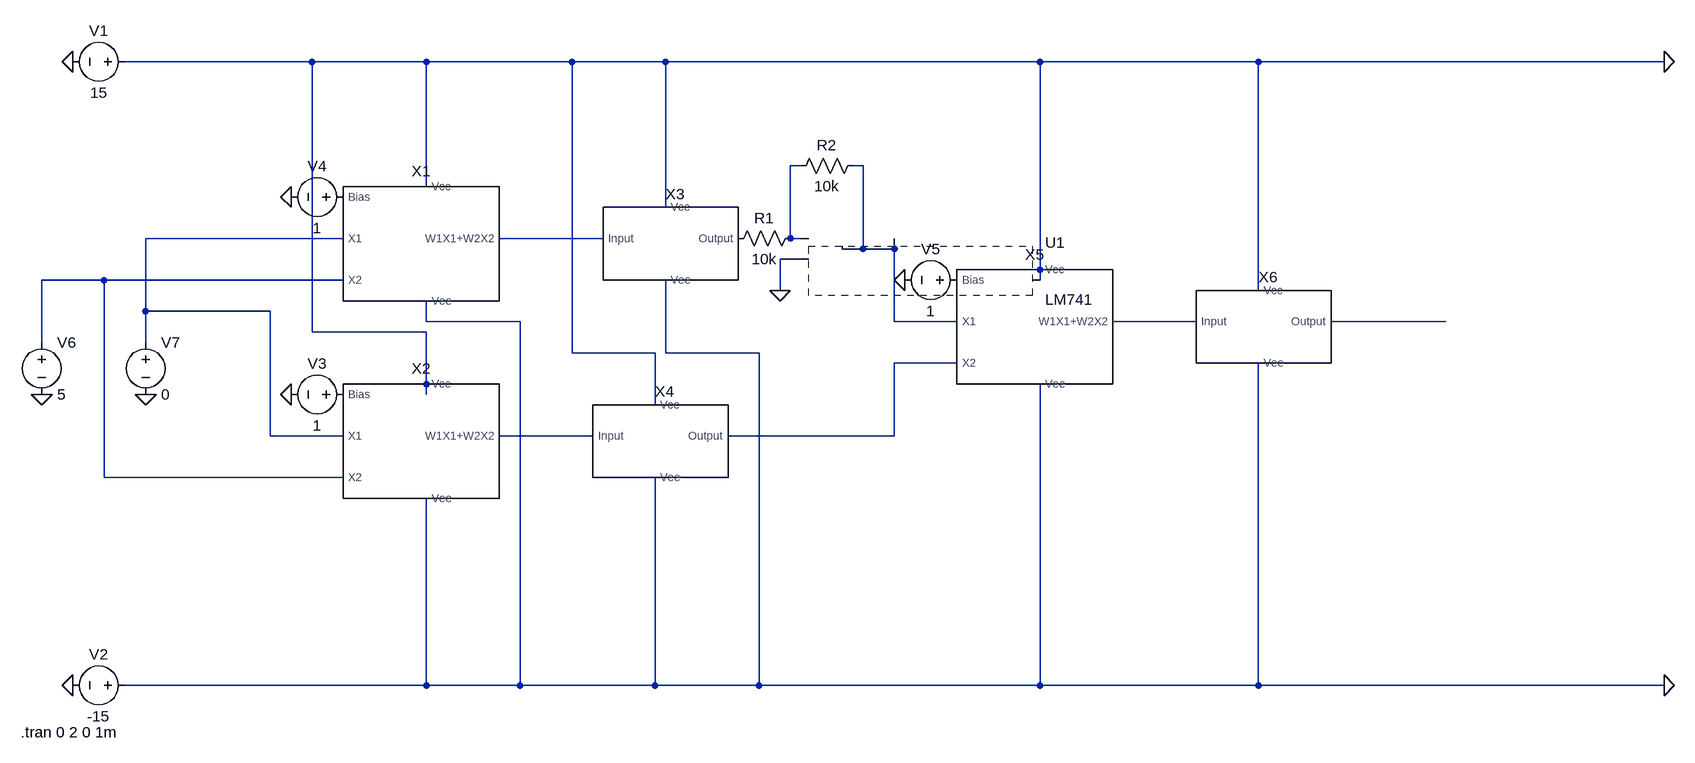
[diagram p0: schematic ANN.asc]
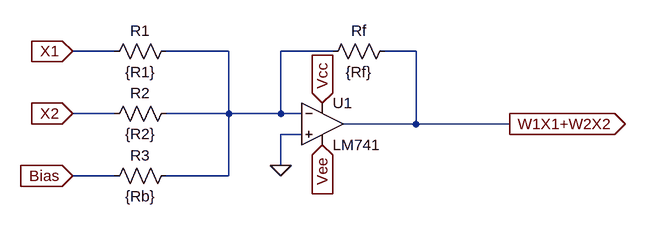
[diagram p1: sub-circuit weight_adder.asc]
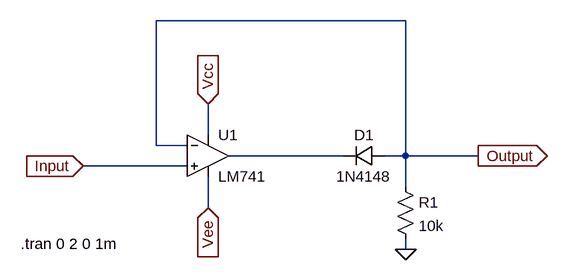
[diagram p2: sub-circuit relu.asc]
ANN.asc, the LTspice schematic file:
Version 4.1
SHEET 1 2036 840
WIRE -64 -208 -352 -208
WIRE 112 -208 -64 -208
WIRE 336 -208 112 -208
WIRE 480 -208 336 -208
WIRE 1056 -208 480 -208
WIRE 1392 -208 1056 -208
WIRE 2016 -208 1392 -208
WIRE 688 -48 672 -48
WIRE 784 -48 768 -48
WIRE 112 -16 112 -208
WIRE 480 16 480 -208
WIRE -16 64 -320 64
WIRE 384 64 224 64
WIRE 672 64 672 -48
WIRE 688 64 672 64
WIRE 784 80 784 -48
WIRE 784 80 752 80
WIRE 832 80 832 64
WIRE 832 80 784 80
WIRE 688 96 656 96
WIRE 1056 112 1056 -208
WIRE -384 128 -480 128
WIRE -16 128 -384 128
WIRE 1056 128 1056 112
WIRE 656 144 656 96
WIRE 1392 144 1392 -208
WIRE -320 176 -320 64
WIRE -128 176 -320 176
WIRE 112 192 112 160
WIRE 256 192 112 192
WIRE 832 192 832 80
WIRE 928 192 832 192
WIRE 1296 192 1168 192
WIRE 1680 192 1504 192
WIRE -64 208 -64 -208
WIRE 112 208 -64 208
WIRE -480 224 -480 128
WIRE -320 224 -320 176
WIRE 336 240 336 -208
WIRE 464 240 336 240
WIRE 480 240 480 128
WIRE 624 240 480 240
WIRE 928 256 832 256
WIRE 112 288 112 208
WIRE 112 304 112 288
WIRE 464 320 464 240
WIRE -128 368 -128 176
WIRE -16 368 -128 368
WIRE 368 368 224 368
WIRE 832 368 832 256
WIRE 832 368 576 368
WIRE -384 432 -384 128
WIRE -16 432 -384 432
WIRE 112 752 112 464
WIRE 112 752 -352 752
WIRE 256 752 256 192
WIRE 256 752 112 752
WIRE 464 752 464 432
WIRE 464 752 256 752
WIRE 624 752 624 240
WIRE 624 752 464 752
WIRE 1056 752 1056 288
WIRE 1056 752 624 752
WIRE 1392 752 1392 256
WIRE 1392 752 1056 752
WIRE 2016 752 1392 752
FLAG -432 -208 0
FLAG 2016 -208 0
FLAG -432 752 0
FLAG 2016 752 0
FLAG -96 0 0
FLAG -96 304 0
FLAG 848 128 0
FLAG 656 144 0
FLAG -480 304 0
FLAG -320 304 0
SYMBOL Weight_Adder 96 64 R0
SYMATTR InstName X1
SYMATTR SpiceLine R1=8.375k R2=9.728k Rf=10k Rb=10k
SYMBOL Weight_Adder 96 368 R0
SYMATTR InstName X2
SYMATTR SpiceLine R1=8.375k R2=9.728k Rf=10k Rb=10k
SYMBOL voltage -336 -208 R90
WINDOW 0 -32 56 VBottom 2
WINDOW 3 32 56 VTop 2
SYMATTR InstName V1
SYMATTR Value 15
SYMBOL voltage -336 752 R90
WINDOW 0 -32 56 VBottom 2
WINDOW 3 32 56 VTop 2
SYMATTR InstName V2
SYMATTR Value -15
SYMBOL ReLU 464 384 R0
SYMATTR InstName X4
SYMBOL ReLU 480 80 R0
SYMATTR InstName X3
SYMBOL Weight_Adder 1040 192 R0
SYMATTR InstName X5
SYMATTR SpiceLine R1=5.97k R2=10.27k Rf=10k Rb=10k
SYMBOL ReLU 1392 208 R0
SYMATTR InstName X6
SYMBOL voltage 0 304 R90
WINDOW 0 -32 56 VBottom 2
WINDOW 3 32 56 VTop 2
SYMATTR InstName V3
SYMATTR Value 1
SYMBOL voltage 0 0 R90
WINDOW 0 -32 56 VBottom 2
WINDOW 3 32 56 VTop 2
SYMATTR InstName V4
SYMATTR Value 1
SYMBOL voltage 944 128 R90
WINDOW 0 -32 56 VBottom 2
WINDOW 3 32 56 VTop 2
WINDOW 123 0 0 Left 0
WINDOW 39 0 0 Left 0
SYMATTR InstName V5
SYMATTR Value 1
SYMBOL LM741 720 16 R0
SYMATTR InstName U1
SYMBOL res 688 48 R90
WINDOW 0 0 56 VBottom 2
WINDOW 3 32 56 VTop 2
SYMATTR InstName R1
SYMATTR Value 10k
SYMBOL res 784 -64 R90
WINDOW 0 0 56 VBottom 2
WINDOW 3 32 56 VTop 2
SYMATTR InstName R2
SYMATTR Value 10k
SYMBOL voltage -480 208 R0
SYMATTR InstName V6
SYMATTR Value 5
SYMBOL voltage -320 208 R0
SYMATTR InstName V7
SYMATTR Value 0
TEXT -512 824 Left 2 !.tran 0 2 0 1m

weight_adder.asc, the sub-circuit schematic file:
Version 4.1
SHEET 1 888 680
WIRE 64 80 0 80
WIRE 240 80 144 80
WIRE 400 80 320 80
WIRE 528 80 480 80
WIRE 64 176 0 176
WIRE 240 176 240 80
WIRE 240 176 144 176
WIRE 320 176 320 80
WIRE 320 176 240 176
WIRE 352 176 320 176
WIRE 528 192 528 80
WIRE 528 192 416 192
WIRE 672 192 528 192
WIRE 352 208 320 208
WIRE 320 256 320 208
WIRE 64 272 0 272
WIRE 240 272 240 176
WIRE 240 272 144 272
FLAG 0 80 X1
IOPIN 0 80 In
FLAG 0 176 X2
IOPIN 0 176 In
FLAG 0 272 Bias
IOPIN 0 272 In
FLAG 672 192 W1X1+W2X2
IOPIN 672 192 Out
FLAG 320 256 0
FLAG 384 160 Vcc
IOPIN 384 160 In
FLAG 384 224 Vee
IOPIN 384 224 In
SYMBOL res 160 64 R90
WINDOW 0 0 56 VBottom 2
WINDOW 3 32 56 VTop 2
SYMATTR InstName R1
SYMATTR Value {R1}
SYMBOL res 160 160 R90
WINDOW 0 0 56 VBottom 2
WINDOW 3 32 56 VTop 2
SYMATTR InstName R2
SYMATTR Value {R2}
SYMBOL res 160 256 R90
WINDOW 0 0 56 VBottom 2
WINDOW 3 32 56 VTop 2
SYMATTR InstName R3
SYMATTR Value {Rb}
SYMBOL res 496 64 R90
WINDOW 0 0 56 VBottom 2
WINDOW 3 32 56 VTop 2
SYMATTR InstName Rf
SYMATTR Value {Rf}
SYMBOL LM741 384 128 R0
SYMATTR InstName U1

relu.asc, the sub-circuit schematic file:
Version 4.1
SHEET 1 880 680
WIRE 544 -32 160 -32
WIRE 240 144 240 96
WIRE 160 160 160 -32
WIRE 208 160 160 160
WIRE 448 176 272 176
WIRE 544 176 544 -32
WIRE 544 176 512 176
WIRE 656 176 544 176
WIRE 208 192 48 192
WIRE 544 224 544 176
WIRE 240 256 240 208
WIRE 544 320 544 304
FLAG 544 320 0
FLAG 48 192 Input
IOPIN 48 192 In
FLAG 656 176 Output
IOPIN 656 176 Out
FLAG 240 96 Vcc
IOPIN 240 96 In
FLAG 240 256 Vee
IOPIN 240 256 In
SYMBOL lib\\lib\\sym\\OpAmps\\LM741 240 112 R0
SYMATTR InstName U1
SYMBOL res 528 208 R0
SYMATTR InstName R1
SYMATTR Value 10k
SYMBOL diode 512 160 R90
WINDOW 0 0 32 VBottom 2
WINDOW 3 32 32 VTop 2
SYMATTR InstName D1
SYMATTR Value 1N4148
TEXT -48 312 Left 2 !.tran 0 2 0 1m

The netlist it stands for:
* ANN.asc
X§X1 P001 0 0 N003 N005 N004 weight_adder params: R1=8.375k R2=9.728k Rf=10k Rb=10k
X§X2 P002 0 0 N003 N005 N009 weight_adder params: R1=8.375k R2=9.728k Rf=10k Rb=10k
V1 0 0 15
V2 0 0 -15
X§X4 N009 0 0 N008 relu
X§X3 N004 0 0 P003 relu
X§X5 P004 0 0 N002 N008 N006 weight_adder params: R1=5.97k R2=10.27k Rf=10k Rb=10k
X§X6 N006 0 0 N007 relu
V3 P002 0 1
V4 P001 0 1
V5 P004 0 1
* U1: LM741 (symbol LM741 not available, pin order unknown); nets seen at it: 0, N001, N002
R1 N001 P003 10k
R2 N002 N001 10k
V6 N005 0 5
V7 N003 0 0

* block symbol definitions
.subckt weight_adder Bias Vcc Vee X1 X2 W1X1+W2X2
R1 N001 X1 {R1}
R2 N001 X2 {R2}
R3 N001 Bias {Rb}
Rf W1X1+W2X2 N001 {Rf}
X§U1 0 N001 Vcc Vee W1X1+W2X2 LM741  ; pins In+ In- V+ V- OUT
.ends weight_adder

.subckt relu Input Vcc Vee Output
X§U1 Input Output Vcc Vee N001 LM741  ; pins In+ In- V+ V- OUT
R1 Output 0 10k
D1 Output N001 1N4148
.tran 0 2 0 1m
.ends relu

.model D D
.lib standard.dio
.tran 0 2 0 1m
.lib LM741.lib
.backanno
.end